# Altium schematic sheet Generator_1kHz.SchDoc
size A4; SheetNumber: 8; SheetTotal: 8; SPICEModelCacheNUSKXPOH: <root> / <DocumentId>NUSKXPOH</DocumentId> / <CacheFrame Number="0"> / <Model Name="xtal" Kind="CKT"> / <Text>*Generic type:crystal pkg:HC33/51 / .SUBCKT XTAL 1 2 PARAMS: FREQ=1Meg RS=750 C=13pf Q=1000 / LX 1 3 {((Q*RS)/(6.2831852*FREQ))} IC=0.5M / CX 3 4 {(1/(Q*6.2831852*FREQ*RS))} / C0 1 2 {C} / RS 4 2 {RS} / .ENDS XTAL</Text> / </Model> / </CacheFrame> / </root>
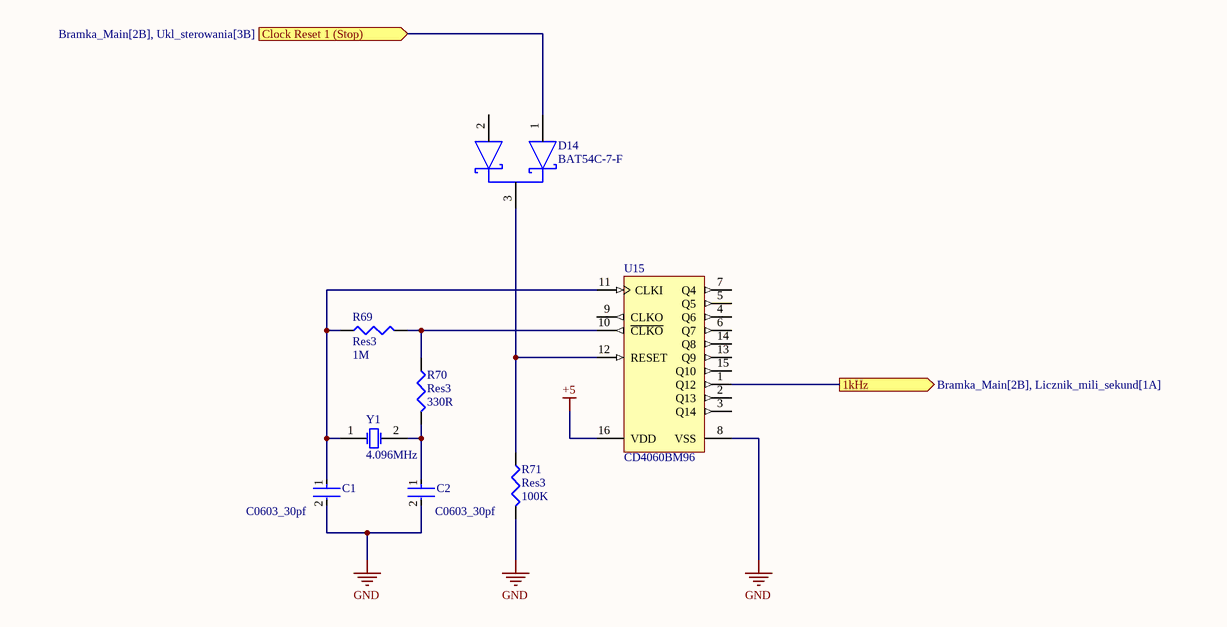
[diagram p0: Generator_1kHz.SchDoc]

## Parts
C1  C0603_30pf  [FP-C0603C-CF-MFG]
C2  C0603_30pf  [FP-C0603C-CF-MFG]
D14  BAT54C-7-F  [FP-SOT23-IPC_B]
R69  Res3  value 1M  [J1-0603]
R70  Res3  value 330R  [J1-0603]
R71  Res3  value 100K  [J1-0603]
U15  CD4060BM96  [D0016A_L]
Y1  4.096MHz  [R38]

## Ports
1kHz (out, see Bramka_Main[2B], Licznik_mili_sekund[1A]), Clock Reset 1 (Stop) (in, see Bramka_Main[2B], Ukl_sterowania[3B])

## Nets
+5: U15.16(VDD)
GND: C1.2 C2.2 R71.2 U15.8(VSS)
1kHz: U15.1(Q12) ; port 1kHz
Clock Reset 1 (Stop): D14.1(1_ANODE) ; port Clock Reset 1 (Stop)
NetC1_1: C1.1 R69.1 U15.11(CLKI) Y1.1(OSC1)
NetC2_1: C2.1 R70.2 Y1.2(OSC2)
NetD14_3: D14.3(COMMON_CATHODE) R71.1 U15.12(RESET)
NetR69_2: R69.2 R70.1 U15.10(~{CLKO})

Not connected (* = marked no-connect by the designer): D14 2(2_ANODE); U15 2(Q13) 3(Q14) 4(Q6) 5(Q5) 6(Q7) 7(Q4) 9(CLKO) 13(Q9) 14(Q8) 15(Q10)

## Library data of the parts
C1 C2 = CMP-1035-00914-3: CAP CER 30PF 50V 5% NP0 0603; Manufacturer Part Number: C0603C300J5GACTU; Manufacturer: KEMET; Automotive Grade: Grade 1; Temperature Coefficient: 30ppm/°C; Material: Ceramic; Temperature Characteristic: C0G; Tolerance: 0.05; ComponentLink2URL: https://api.kemet.com/component-edge/download/datasheet/C0603C100J5GACAUTO.pdf; Automotive: Yes; Device Class L2: Capacitors; Device Class L1: Passive Components; Device Class L3: Ceramic Capacitors; RoHS: TRUE; Octopart: https://octopart.com/c0603c300j5gactu-kemet-199455; Lead Free: Yes; Value: 30 pF; Temperature Range High: +125°C; Category: Cap; Temperature: -55°C to +125°C; Package: C0603C-CF; Capacitance: 30 pF; Digikey Description: CAP CER 30PF 50V 5% NP0 0603; Height: 0.87mm; ComponentLink2Description: Datasheet; Temperature Range Low: -55°C; Mouser Description: Multilayer Ceramic Capacitors MLCC - SMD/SMT 50volts 30pF C0G 5%; Voltage Rating: 50 V
D14 = CMP-12790-000084-1: DIODE ARRAY SCHOTTKY 30V SOT23-3; Max Reverse Current: 2uA; Power Dissipation: 200mW; Average Rectified Current: 200mA; Capacitance: 10pF; Peak Non-Repetitive Surge Current: 600mA; Forward Voltage: 800mV; Reverse Recovery Time: 5ns; Element Configuration: Common Cathode; Max Operating Temperature: 150°C; Max Reverse Voltage (DC): 30V; Power Rating: 200mW; Termination: SMD/SMT; REACH SVHC: No SVHC; Voltage Rating (DC): 30V; Series: -; Current Rating: 200mA; RoHS Compliant: Yes; Max Power Dissipation: 200mW; Case/Package: SOT-23; Max Repetitive Reverse Voltage (Vrrm): 30V; Width: 1.3mm; Min Operating Temperature: -65°C; Lead Free: Lead Free; Forward Current: 200mA; Number of Pins: 3; Contact Plating: Tin; Package Quantity: 3000; Length: 2.9mm; Radiation Hardening: No; Max Forward Surge Current (Ifsm): 600mA; Height: 1mm; Packaging: Tape and Reel; Mount: Surface Mount; Weight: 0.000282oz
R69-R71 = Res3: Resistor; Published: 8-Jun-2000; LatestRevisionDate: 29-May-2009; LatestRevisionNote: IPC-7351 Footprint Added.; PackageReference: J1-0603; Publisher: Altium Limited; PackageDescription: Chip Resistor
U15 = CMP-1086-00004-4: CMOS 14-Stage Ripple Carry Binary Counter / Divider and Oscillator, 3 to 18 V, -55 to 125 degC, 16-Pin SOIC (D), Green (RoHS & no Sb/Br), Tape and Reel; Manufacturer: Texas Instruments; tPHL, tPLH (typ) @ 5 V: 370 ns; VDD: 3 to 18 V; Mounting Technology: Surface Mount; PackageReference: D0016A; ComponentLink3URL: http://www.ti.com/lit/ml/mpds178g/mpds178g.pdf; ComponentLink3Description: Package Specification; ComponentLink2URL: http://www.ti.com/lit/ds/symlink/cd4060b.pdf; PackageVersion: 4040047-6/M; PackageDescription: 16-Pin Plastic Small-Outline Package, Body 9.9 x 3.9 mm, Pitch 1.27 mm; DatasheetVersion: SCHS049C; PartNumber: CD4060BM96; ComponentLink2Description: Datasheet; Note1: Green (RoHS & no Sb/Br); ComponentLink1Description: Manufacturer URL; Temperature Range: -55 to 125 degC; Packing: Tape and Reel; ComponentLink1URL: http://www.ti.com
Y1 = XTAL: Crystal Oscillator; Published: 8-Jun-2000; LatestRevisionDate: 17-Jul-2002; LatestRevisionNote: Re-released for DXP Platform.; PackageReference: R38; Publisher: Altium Limited; PackageDescription: Crystal, Thru-Hole; 2 Leads; Body 3.1 x 8.2 mm (Dia.xH)